# EAGLE schematic String_Thing_Pen_1.0 (EAGLE 6.1)
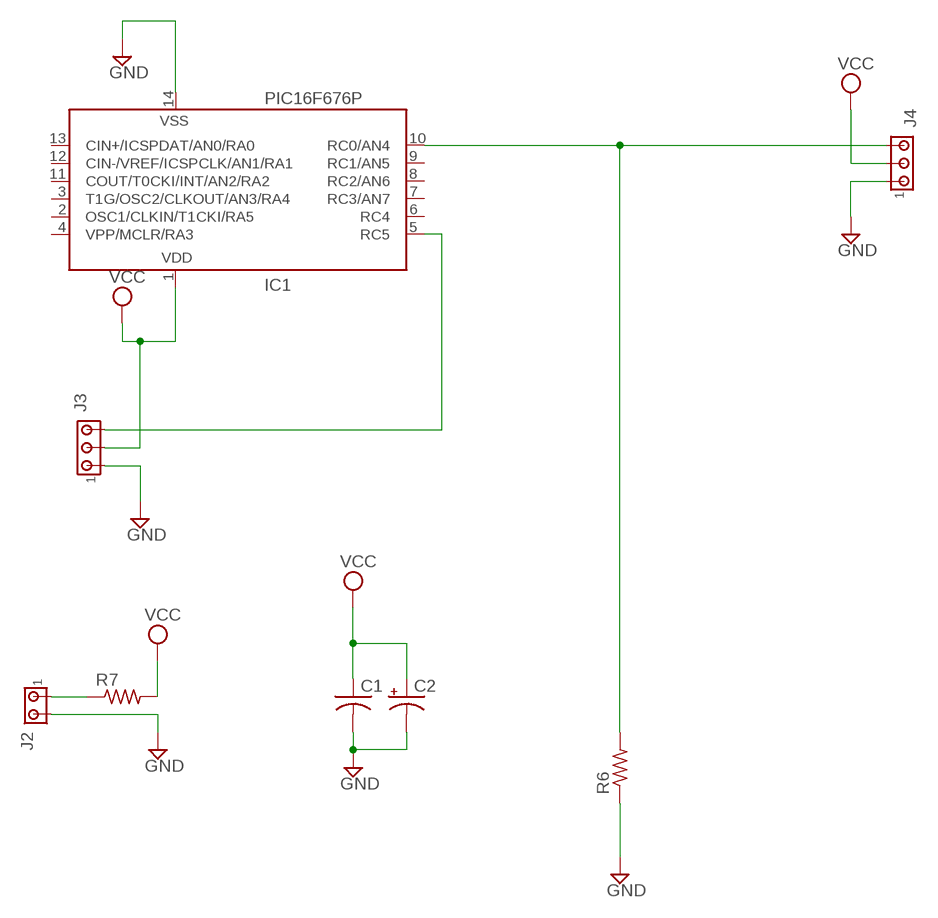
[diagram p0: schematic, sheet 1]

## Parts
C1  C-US025-025X050  [C025-025X050]
C2  CPOL-USE2.5-5  [E2,5-5]
IC1  PIC16F676P  [DIL14]
J2  MTA02-100  [10X02MTA]
J3  MTA03-100  [10X03MTA]
J4  MTA03-100  [10X03MTA]
R6  R-US_0207/10  [0207/10]
R7  R-US_0207/10  [0207/10]

## Nets
GND: C1.2 C2.- IC1.14(VSS) J2.2 J3.1 J4.1 R6.1
N$4: IC1.10(RC0/AN4) J4.3 R6.2
N$9: J2.1 R7.1
N$10: IC1.5(RC5) J3.3
VCC: C1.1 C2.+ IC1.1(VDD) J3.2 J4.2 R7.2
Unconnected: IC1.2(OSC1/CLKIN/T1CKI/RA5) IC1.3(T1G/OSC2/CLKOUT/AN3/RA4) IC1.4(VPP/MCLR/RA3) IC1.6(RC4) IC1.7(RC3/AN7) IC1.8(RC2/AN6) IC1.9(RC1/AN5) IC1.11(COUT/T0CKI/INT/AN2/RA2) IC1.12(CIN-/VREF/ICSPCLK/AN1/RA1) IC1.13(CIN+/ICSPDAT/AN0/RA0)

## Library data of the parts
C1 = adafruit:C-US: CAPACITOR, American symbol
C2 = adafruit:CPOL-US: POLARIZED CAPACITOR, American symbol
IC1 = microchip:PIC16F676: 14-Pin, Flash-Based 8-Bit CMOS Microcontroller High Performance RISC CPU: * Only 35 instructions to learn - All single-cycle instructions except branches * Operating speed: - DC - 20 MHz oscillator/clock input - DC - 200 ns instruction cycle * Internal and external oscillator options - Precision Internal 4 MHz oscillator factory calibrated to ±1% - External Oscillator support for crystals and resonators - 5?s wake-up from SLEEP, 3.0V, typical * Power saving SLEEP mode * Wide operating voltage range - 2.0V to 5.5V * Industrial and Extended temperature range * Low power Power-on Reset (POR) * Power-up Timer (PWRT) and Oscillator Start-up Timer (OST) * Brown-out Detect (BOD) * Watchdog Timer (WDT) with independent oscillator for reliable operation * Multiplexed MCLR/Input-pin * Interrupt-on-pin change * Individual programmable weak pull-ups * Programmable code protection * High Endurance FLASH/EEPROM Cell - 100,000 write FLASH endurance - 1,000,000 write EEPROM endurance - FLASH/Data EEPROM Retention: > 40 years * Standby Current: - 1 nA @ 2.0V, typical * Operating Current: - 8.5?A @ 32 kHz, 2.0V, typical - 100?A @ 1 MHz, 2.0V, typical * Watchdog Timer Current - 300 nA @ 2.0V, typical * Timer1 oscillator current: - 4?A @ 32 kHz, 2.0V, typical * 12 I/O pins with individual direction control * High current sink/source for direct LED drive * Analog-to-Digital Converter module (PIC16F676): - 10-bit resolution - Programmable 8-channel input - Voltage reference input * In-Circuit Serial ProgrammingTM (ICSPTM) via two pins Source: http://ww1.microchip.com/downloads/en/DeviceDoc/40039E.pdf; MF: MICROCHIP; MPN: PIC16F676-I/P; OC_FARNELL: 9760512; OC_NEWARK: 54K2829
J2 = con-amp:MTA02-100: AMP connector
J3 J4 = con-amp:MTA03-100: AMP connector
R6 R7 = resistor:R-US_: RESISTOR, American symbol